# Altium schematic sheet SCH_SPEAKER.SchDoc
size A3; SheetNumber: 9; SheetTotal: 10
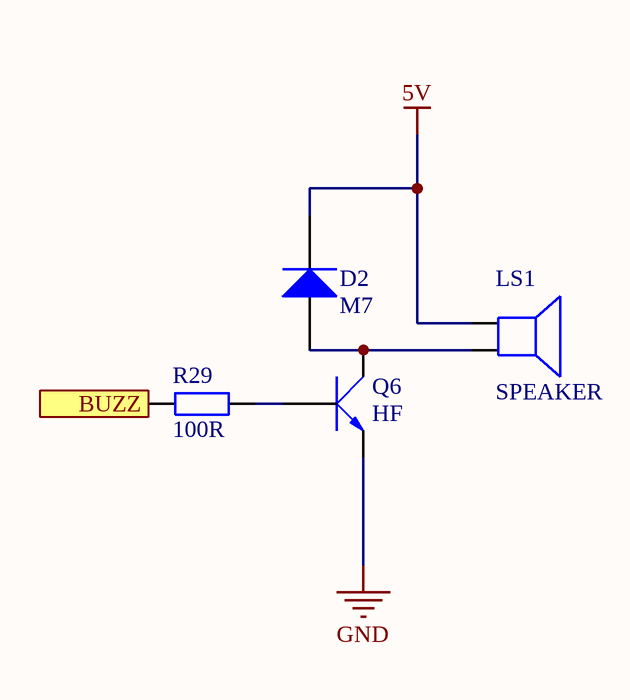
[diagram p0: SCH_SPEAKER.SchDoc]

## Parts
D2  M7  [DIODE SMA]
LS1  SPEAKER  [Coi Chip Speacker]
Q6  HF  [SOT23]
R29  100R  [tro smd 0805]

## Ports
BUZZ (in)

## Nets
5V: D2.2(K) LS1.1
GND: Q6.2(E)
BUZZ: R29.1 ; port BUZZ
NetD2_1: D2.1(A) LS1.2 Q6.3(C)
NetQ6_1: Q6.1(B) R29.2

## Library data of the parts
D2 = Diode M7 ( 4007 ): Dán; Don_Vi: Con; Ten_Linh_Kien: Diode M7 1N4007 SMD 1A 1000V; Ma_Hang: MH000944; Chung_Loai: Dán; Ghi_Chu: *
LS1 = Coi Chip Speaker: Còi chip
Q6 = C1815 HF SMD: NPN transistor; Value: C9014
R29 = Tro 0805 5% 100R: Dán; Don_Vi: Con; So_Chan: 2; Ten_Linh_Kien: Trở 0805 5% 100R; Ma_Hang: MH005251; Chung_Loai: Dán; Kieu_Chan: *